# EAGLE design HS100R (EAGLE 7.2.0)
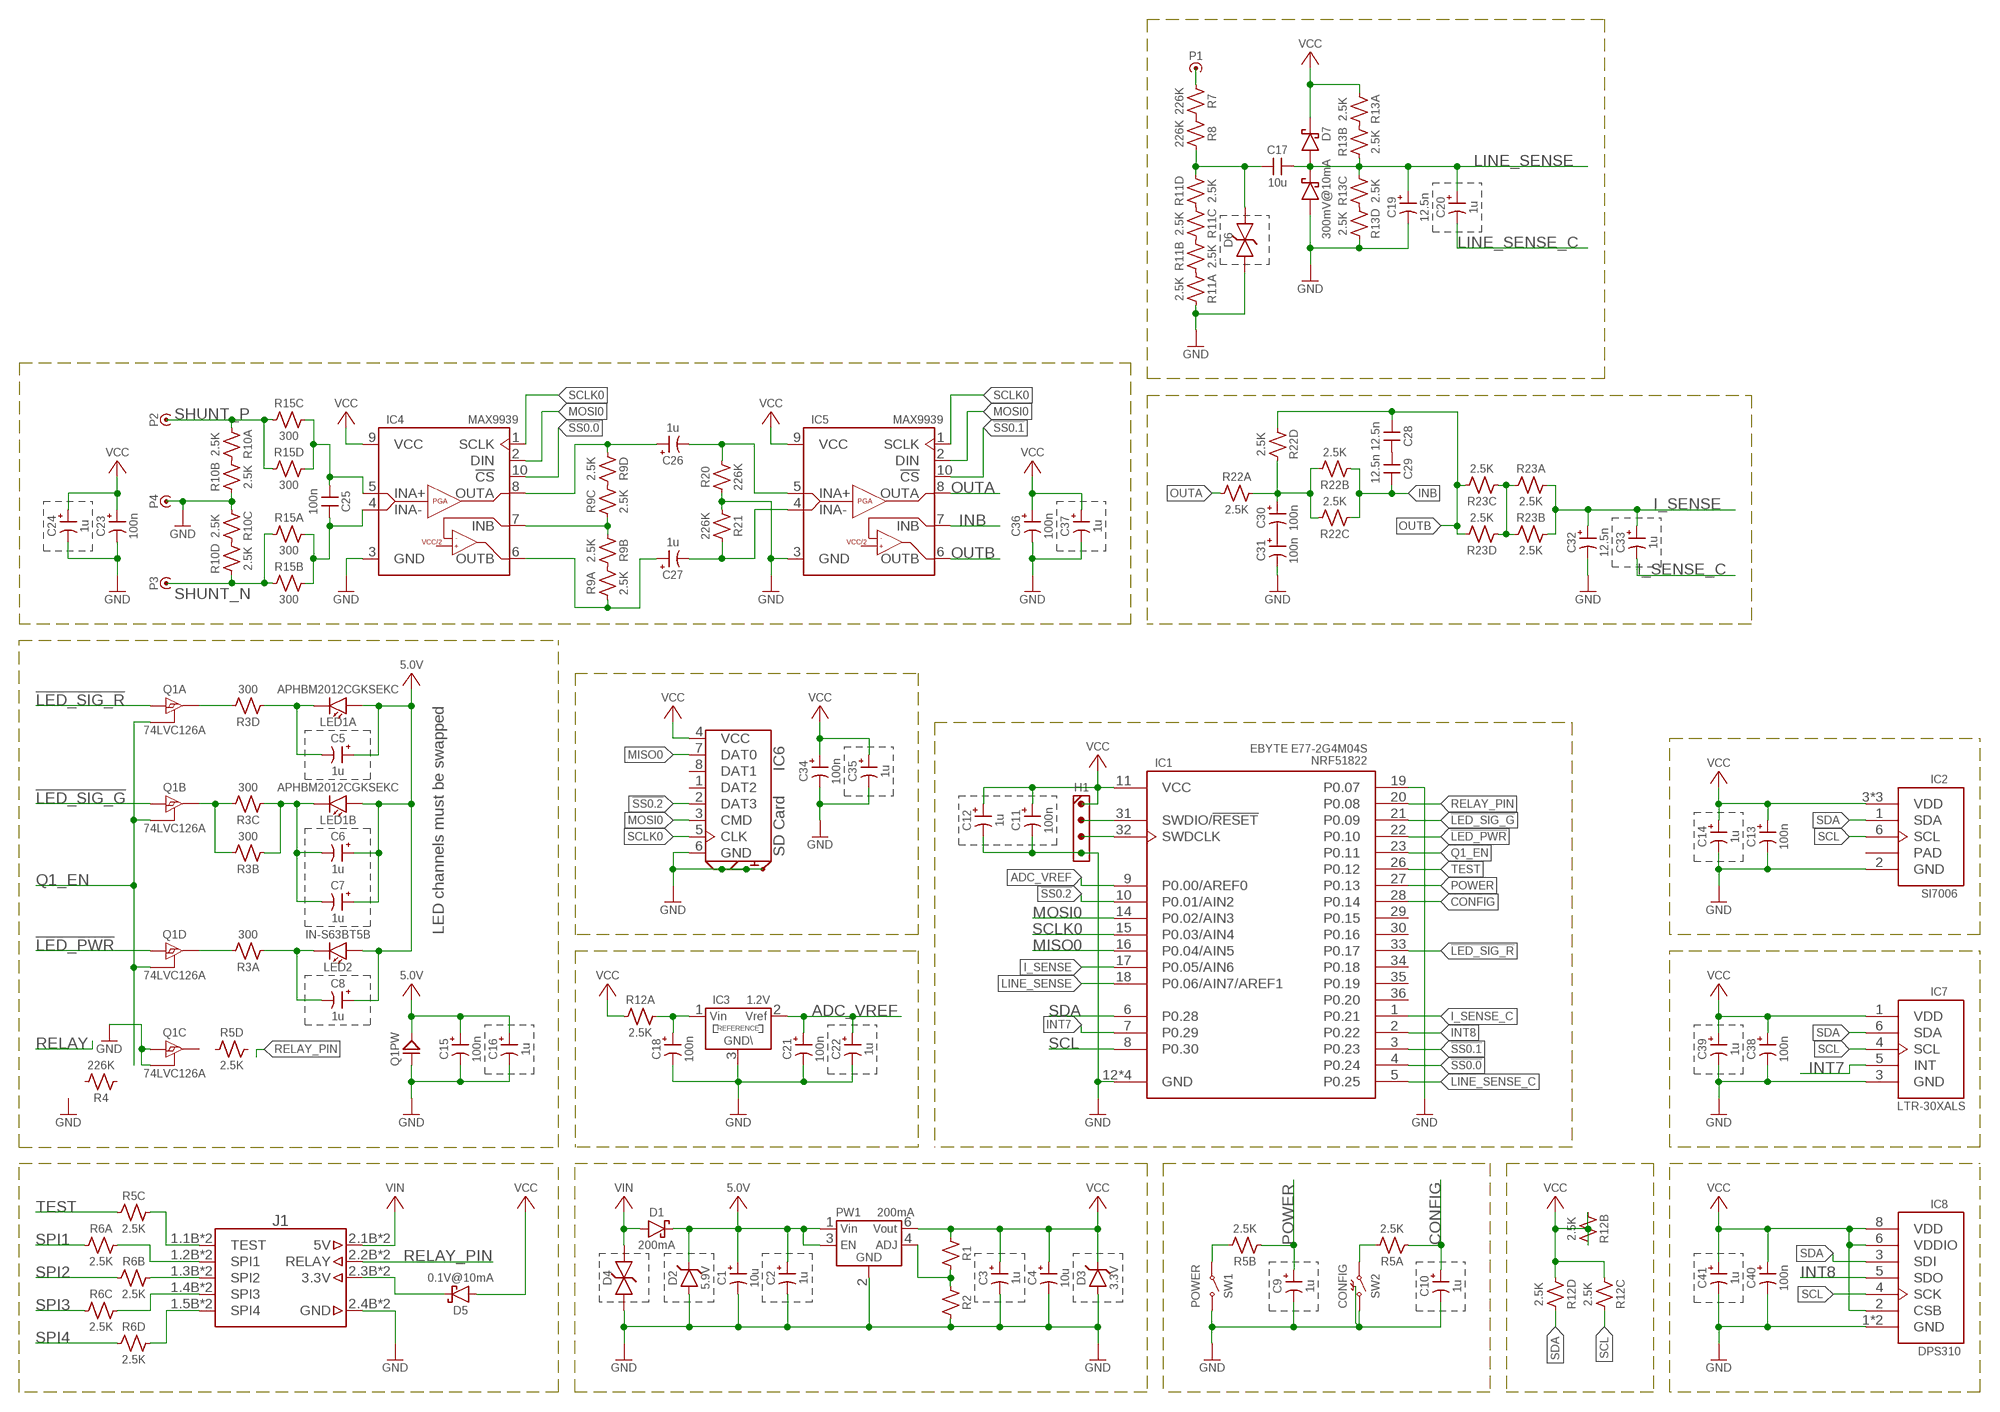
[diagram p0: schematic, sheet 1]

## Parts
C1  10u  CAPACITOR-POL-1206  [1206]
C2  1u  CAPACITOR-POL-0805  [0805]
C3  1u  CAPACITOR-POL-0805  [0805]
C4  10u  CAPACITOR-POL-1206  [1206]
C5  1u  CAPACITOR-POL-0805  [0805]
C6  1u  CAPACITOR-POL-0805  [0805]
C7  1u  CAPACITOR-POL-0805  [0805]
C8  1u  CAPACITOR-POL-0805  [0805]
C9  1u  CAPACITOR-POL-0805  [0805]
C10  1u  CAPACITOR-POL-0805  [0805]
C11  100n  CAPACITOR-POL-0603  [0603]
C12  1u  CAPACITOR-POL-0805  [0805]
C13  100n  CAPACITOR-POL-0603  [0603]
C14  1u  CAPACITOR-POL-0805  [0805]
C15  100n  CAPACITOR-POL-0603  [0603]
C16  1u  CAPACITOR-POL-0805  [0805]
C17  10u  CAPACITOR-1206  [1206]
C18  100n  CAPACITOR-POL-0603  [0603]
C19  12.5n  CAPACITOR-POL-0603  [0603]
C20  1u  CAPACITOR-POL-0805  [0805]
C21  100n  CAPACITOR-POL-0603  [0603]
C22  1u  CAPACITOR-POL-0805  [0805]
C23  100n  CAPACITOR-POL-0603  [0603]
C24  1u  CAPACITOR-POL-0805  [0805]
C25  100n  CAPACITOR-0603  [0603]
C26  1u  CAPACITOR-POL-0805  [0805]
C27  1u  CAPACITOR-POL-0805  [0805]
C28  12.5n  CAPACITOR-0603  [0603]
C29  12.5n  CAPACITOR-0603  [0603]
C30  100n  CAPACITOR-POL-0603  [0603]
C31  100n  CAPACITOR-POL-0603  [0603]
C32  12.5n  CAPACITOR-POL-0603  [0603]
C33  1u  CAPACITOR-POL-0805  [0805]
C34  100n  CAPACITOR-POL-0603  [0603]
C35  1u  CAPACITOR-POL-0805  [0805]
C36  100n  CAPACITOR-POL-0603  [0603]
C37  1u  CAPACITOR-POL-0805  [0805]
C38  100n  CAPACITOR-POL-0603  [0603]
C39  1u  CAPACITOR-POL-0805  [0805]
C40  100n  CAPACITOR-POL-0603  [0603]
C41  1u  CAPACITOR-POL-0805  [0805]
D1  200mA  DIODE_SCHOTTKY-SOD-323F  [SOD-323F]
D2  5.9V  DIODE_ZENER-SOD-323F  [SOD-323F]
D3  3.3V  DIODE_ZENER-SOD-323F  [SOD-323F]
D4  DIODE_TVS_SOD-323F  [SOD-323F]
D5  0.1V@10mA  DIODE_SCHOTTKY-SOD-323F  [SOD-323F]
D6  DIODE_TVS_SOD-323F  [SOD-323F]
D7  300mV@10mA  DIODE_SCHOTTKY-2S_SOT-23  [SOT-23]
H1  HEADER_4X1-4X1  [PIN_1_4X1]
IC1  EBYTE_E77-2G4M04S  [EBYTE_E77-2G4M04S]
IC2  SI7006-A20  [DFN-6_3.0_PAD]
IC3  1.2V  VREF_SOT-23  [SOT-23]
IC4  MAX9939_UMAX-10  [UMAX-10]
IC5  MAX9939_UMAX-10  [UMAX-10]
IC6  SD-CARD-MICRO-B  [SD-MICRO-SPRINGED-B]
IC7  LTR-30XALS  [LTR-30XALS]
IC8  DPS310  [LGA-8_2.0X2.5_0.65]
J1  PCB_CONNECTOR  [PCB_CONNECTOR]
LED1  APHBM2012CGKSEKC  LED-2X-2.00X1.25  [LED_DUAL-2.00X1.25]
LED2  IN-S63BT5B  LED-0603  [0603]
P1  PIN-PIN_R_0.6  [PIN_R_0.6_1X1]
P2  PIN-PIN_R_0.6  [PIN_R_0.6_1X1]
P3  PIN-PIN_R_0.6  [PIN_R_0.6_1X1]
P4  PIN-PIN_R_0.6  [PIN_R_0.6_1X1]
PW1  200mA  VREG_ADJ_EN-SOT-23-5  [SOT-23-5]
Q1  74LVC126A  GATE-BUFFER-TRI-4X-SSOP-14_4.4  [SSOP-14_4.4]
R1  RESISTOR-0603  [0603]
R2  RESISTOR-0603  [0603]
R3  300  RESISTOR-4X-1206  [1206-QUAD]
R4  226K  RESISTOR-1206  [1206]
R5  2.5K  RESISTOR-4X-1206  [1206-QUAD]
R6  2.5K  RESISTOR-4X-1206  [1206-QUAD]
R7  226K  RESISTOR-1206  [1206]
R8  226K  RESISTOR-1206  [1206]
R9  2.5K  RESISTOR-4X-1206  [1206-QUAD]
R10  2.5K  RESISTOR-4X-1206  [1206-QUAD]
R11  2.5K  RESISTOR-4X-1206  [1206-QUAD]
R12  2.5K  RESISTOR-4X-1206  [1206-QUAD]
R13  2.5K  RESISTOR-4X-1206  [1206-QUAD]
R15  300  RESISTOR-4X-1206  [1206-QUAD]
R20  226K  RESISTOR-1206  [1206]
R21  226K  RESISTOR-1206  [1206]
R22  2.5K  RESISTOR-4X-1206  [1206-QUAD]
R23  2.5K  RESISTOR-4X-1206  [1206-QUAD]
SW1  POWER  SWITCH-GULLWING-4_4.2X3.2  [GULLWING-4_4.2X3.2]
SW2  CONFIG  SWITCH_SHIELD-RA_4.5X4.5  [SWITCH-RA_4.5X4.5]

## Nets
5.0V: C1.C(P) C2.C(P) C5.C(P) C6.C(P) C7.C(P) C8.C(P) C15.C(P) C16.C(P) D1.C D2.C LED1.A1(A:ANODE) LED1.A2(B:ANODE) LED2.A(ANODE) PW1.1(VIN) PW1.3(EN) Q1.14(PW:VCC) ; supply symbol labelled VCC-5.0V
!LED_PWR: IC1.22(P0.10) Q1.12(D:IN)
!LED_SIG_G: IC1.21(P0.09) Q1.5(B:IN)
!LED_SIG_R: IC1.33(P0.17) Q1.2(A:IN)
!SS0.0: IC1.4(P0.24) IC4.10(!CS)
!SS0.1: IC1.3(P0.23) IC5.10(!CS)
!SS0.2: IC1.10(P0.01/AIN2) IC6.2(DAT3)
ADC_VREF: C21.C(P) C22.C(P) IC1.9(P0.00/AREF0) IC3.2(VOUT)
CONFIG: C10.C(P) IC1.28(P0.14) R5.1
GND: C1.A(N) C2.A(N) C3.A(N) C4.A(N) C9.A(N) C10.A(N) C11.A(N) C12.A(N) C13.A(N) C14.A(N) C15.A(N) C16.A(N) C18.A(N) C19.A(N) C21.A(N) C22.A(N) C23.A(N) C24.A(N) C31.A(N) C32.A(N) C34.A(N) C35.A(N) C36.A(N) C37.A(N) C38.A(N) C39.A(N) C40.A(N) C41.A(N) D2.A D3.A D4.A D6.A D7.1(A) H1.1.4 IC1.12(GND) IC1.13(GND) IC1.19(P0.07) IC1.24(GND) IC1.25(GND) IC2.2(GND) IC3.3(GND) IC4.3(GND) IC5.3(GND) IC6.6(GND) IC6.DETECT(DETECT1) IC6.SHIELD1(SHIELD) IC6.SHIELD2(SHIELD) IC6.SHIELD3(SHIELD) IC6.SHIELD4(DETECT2) IC7.3(GND) IC8.1(GND) IC8.7(GND) J1.2.4B(GND) J1.2.4T(GND) P4.1.1 PW1.2(GND) Q1.7(PW:GND) Q1.9(C:IN) Q1.10(C:OE) R2.C R10.2 R10.3 R11.8 R13.5 R20.A R21.A SW1.3 SW1.4 SW2.2 SW2.SHIELD
I_SENSE: C32.C(P) C33.C(P) IC1.17(P0.05/AIN6) R23.7 R23.8
I_SENSE_C: C33.A(N) IC1.1(P0.21)
INB: C29.C IC5.7(INB) R22.2 R22.3
INT7: IC1.7(P0.29) IC7.5(INT)
INT8: IC1.2(P0.22) IC8.5(SDO)
LINE_SENSE: C17.C C19.C(P) C20.C(P) D7.3(COMMON) IC1.18(P0.06/AIN7/AREF1) R13.2 R13.6
LINE_SENSE_C: C20.A(N) IC1.5(P0.25)
MISO0: IC1.16(P0.04/AIN5) IC6.7(DAT0)
MOSI0: IC1.14(P0.02/AIN3) IC4.2(DIN) IC5.2(DIN) IC6.3(CMD)
N$1: D5.C J1.2.3B(3.3V) J1.2.3T(3.3V)
N$2: Q1.3(A:OUT) R3.5
N$3: PW1.4(ADJ) R1.C R2.A
N$4: C5.A(N) LED1.K1(A:CATHODE) R3.4
N$5: Q1.11(D:OUT) R3.8
N$6: Q1.6(B:OUT) R3.6 R3.7
N$7: C8.A(N) LED2.C(CATHODE) R3.1
N$8: J1.1.2B(SPI1) J1.1.2T(SPI1) R6.8
N$9: C6.A(N) C7.A(N) LED1.K2(B:CATHODE) R3.2 R3.3
N$10: R5.7 SW1.1 SW1.2
N$11: R11.3 R11.4
N$12: R5.8 SW2.1
N$13: J1.1.1B(TEST) J1.1.1T(TEST) R5.6
N$14: J1.1.3B(SPI2) J1.1.3T(SPI2) R6.7
N$15: J1.1.4B(SPI3) J1.1.4T(SPI3) R6.6
N$16: J1.1.5B(SPI4) J1.1.5T(SPI4) R6.5
N$17: P1.1.1 R7.A
N$18: R7.C R8.A
N$19: H1.1.3 IC1.32(SWDCLK)
N$20: H1.1.2 IC1.31(SWDIO/!RESET)
N$21: C17.A D6.C R8.C R11.5
N$22: C18.C(P) IC3.1(VIN) R12.8
N$23: R13.7 R13.8
N$24: R13.3 R13.4
N$25: C25.A IC4.5(INA+) R15.5 R15.6
N$26: C25.C IC4.4(INA-) R15.7 R15.8
N$27: IC4.7(INB) R9.2 R9.3
N$28: C28.C C29.A
N$29: R11.6 R11.7
N$30: C30.C(P) R22.5 R22.6 R22.7 R22.8
N$31: C26.A(N) IC5.5(INA+) R20.C
N$32: R23.1 R23.2 R23.3 R23.4
N$33: C27.A(N) IC5.4(INA-) R21.C
N$34: C26.C(P) IC4.8(OUTA) R9.4
N$35: R9.5 R9.6
N$36: C30.A(N) C31.C(P)
N$37: R9.7 R9.8
N$38: C27.C(P) IC4.6(OUTB) R9.1
N$39: R10.5 R10.6
N$40: R10.7 R10.8
N$41: R11.1 R11.2
OUTA: IC5.8(OUTA) R22.1
OUTB: C28.A IC5.6(OUTB) R22.4 R23.5 R23.6
POWER: C9.C(P) IC1.27(P0.13) R5.2
Q1_EN: IC1.23(P0.11) Q1.1(A:OE) Q1.4(B:OE) Q1.13(D:OE)
RELAY_PIN: IC1.20(P0.08) J1.2.2B(RELAY) J1.2.2T(RELAY)
SCL: IC1.8(P0.30) IC2.6(SCL) IC7.4(SCL) IC8.4(SCK) R12.6
SCLK0: IC1.15(P0.03/AIN4) IC4.1(SCLK) IC5.1(SCLK) IC6.5(CLK)
SDA: IC1.6(P0.28) IC2.1(SDA) IC7.6(SDA) IC8.3(SDI) R12.5
SHUNT_N: P3.1.1 R10.4 R15.1 R15.2
SHUNT_P: P2.1.1 R10.1 R15.3 R15.4
SPI1: R6.1
SPI2: R6.2
SPI3: R6.3
SPI4: R6.4
TEST: IC1.26(P0.12) R5.3
VCC: C3.C(P) C4.C(P) C11.C(P) C12.C(P) C13.C(P) C14.C(P) C23.C(P) C24.C(P) C34.C(P) C35.C(P) C36.C(P) C37.C(P) C38.C(P) C39.C(P) C40.C(P) C41.C(P) D3.C D5.A D7.2(C) H1.1.1 IC1.11(VCC) IC2.3(VDD) IC2.4(VDD) IC2.5(VDD) IC4.9(VCC) IC5.9(VCC) IC6.4(VCC) IC7.1(VDD) IC8.2(CSB) IC8.6(VDDIO) IC8.8(VDD) PW1.6(VOUT) R1.A R12.1 R12.2 R12.3 R12.4 R12.7 R13.1
VIN: D1.A D4.C J1.2.1B(5V) J1.2.1T(5V)
Unconnected: IC1.29(P0.15) IC1.30(P0.16) IC1.34(P0.18) IC1.35(P0.19) IC1.36(P0.20) IC2.CENTER(PAD) IC6.1(DAT2) IC6.8(DAT1) Q1.8(C:OUT) R4.A R4.C R5.4 R5.5

## Notes on the sheet
- LED channels must be swapped

## Library data of the parts
C1-C16 C18-C24 C26 C27 C30-C41 = MainLib:CAPACITOR-POL: Standard SMD Capacitor
C17 C25 C28 C29 = MainLib:CAPACITOR: Standard SMD Capacitor
D1 D5 = MainLib:DIODE_SCHOTTKY
D2 D3 = MainLib:DIODE_ZENER
D4 D6 = MainLib:DIODE_TVS
D7 = MainLib:DIODE_SCHOTTKY-2S
H1 = Modules:HEADER_4X1
IC1 = Modules:EBYTE_E77-2G4M04S
IC2 = MainLib:SI7006-A20
IC3 = MainLib:VREF
IC4 IC5 = MainLib:MAX9939
IC6 = MainLib:SD-CARD
IC7 = MainLib:LTR-30XALS
IC8 = MainLib:DPS310
J1 = HS100R:PCB_CONNECTOR
LED1 = MainLib:LED-2X
LED2 = MainLib:LED
P1-P4 = Modules:PIN
PW1 = MainLib:VREG_ADJ_EN
Q1 = MainLib:GATE-BUFFER-TRI-4X
R1 R2 R4 R7 R8 R20 R21 = MainLib:RESISTOR: Standard SMD Resistor
R3 R5 R6 R9-R13 R15 R22 R23 = MainLib:RESISTOR-4X
SW1 = MainLib:SWITCH
SW2 = MainLib:SWITCH_SHIELD

## Board
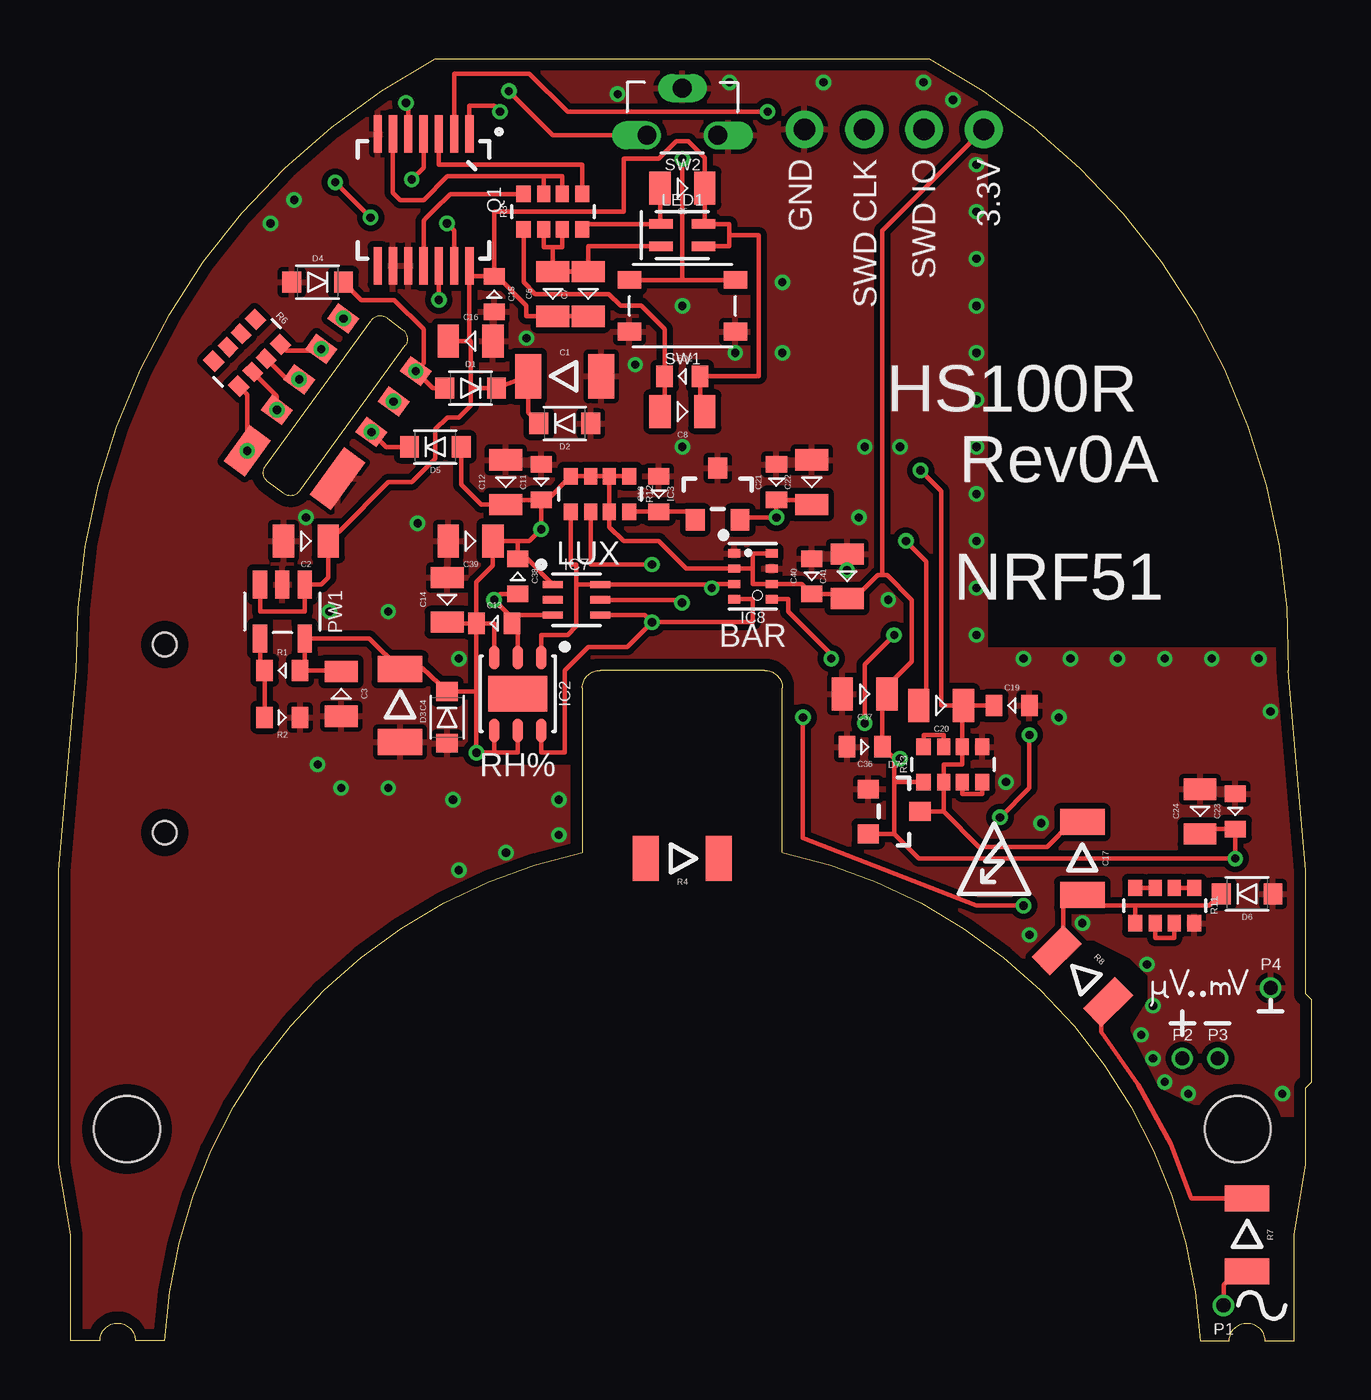
[diagram p1: board, top side]
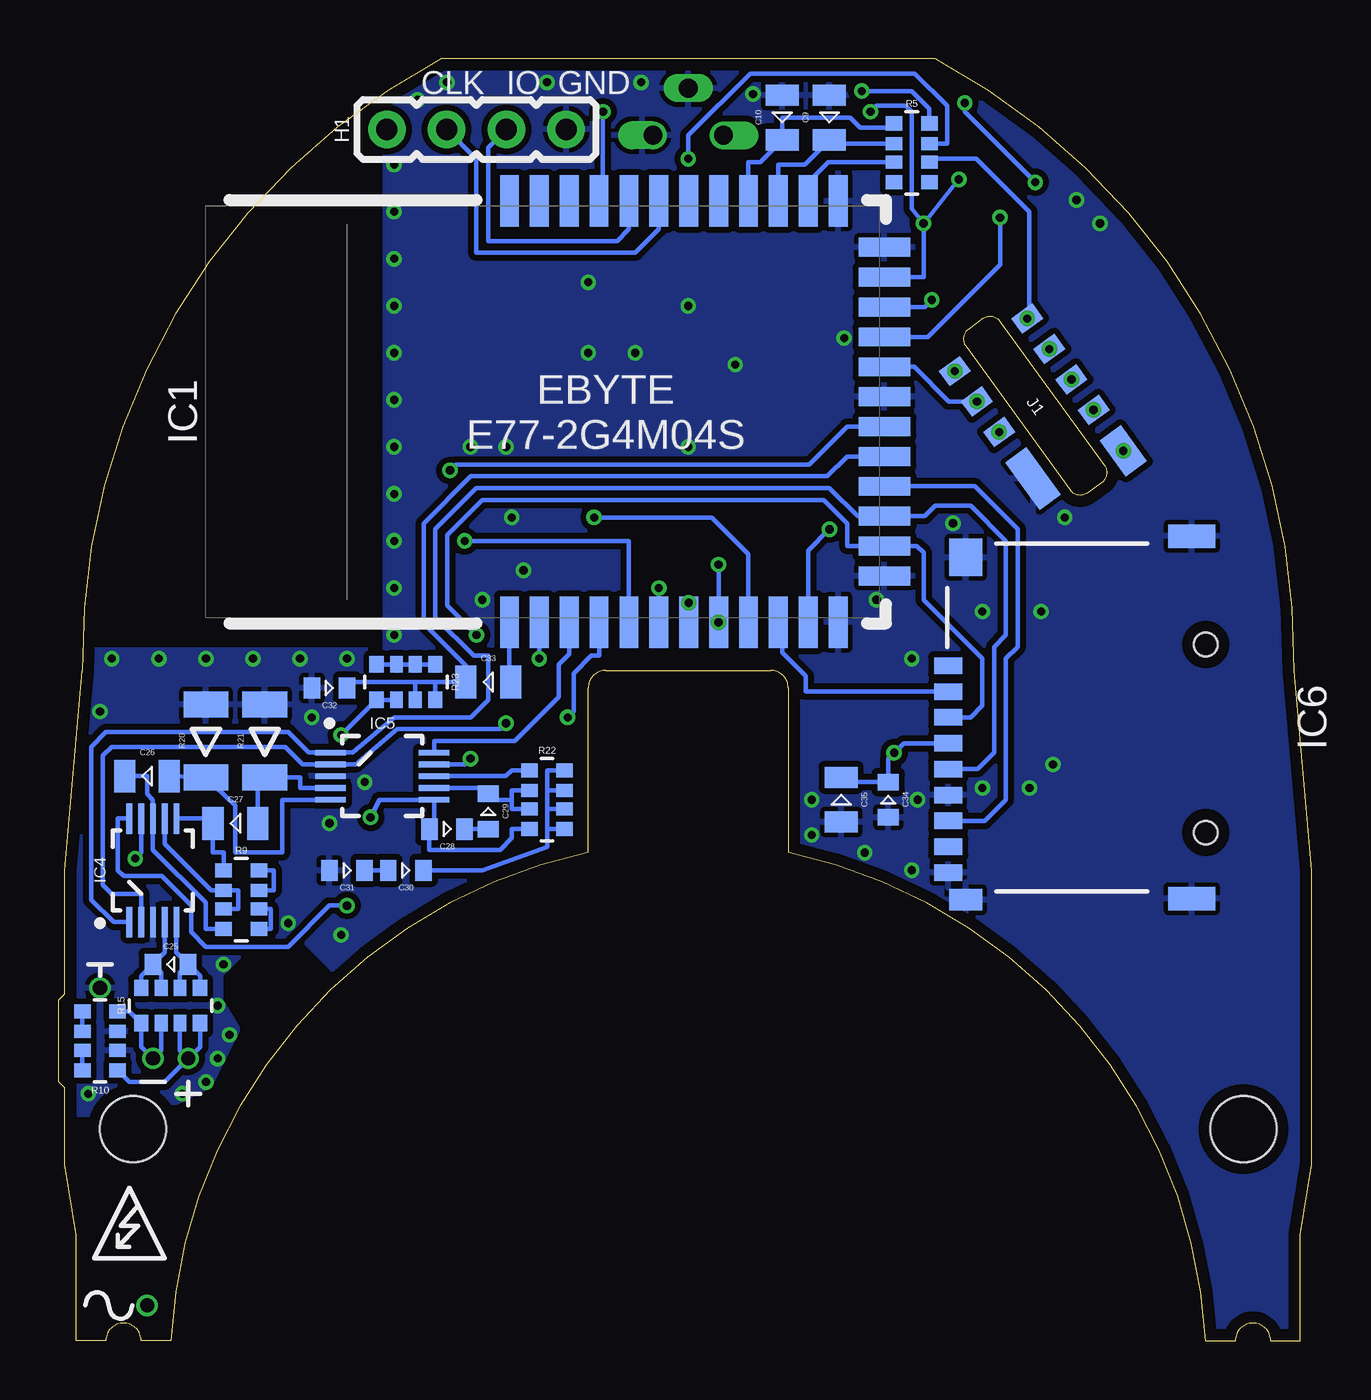
[diagram p2: board, bottom side, seen from below]

Size 53.25 x 54.5 mm. Coordinates in mm from the lower left corner, seen from the top.
Outline: 48.5,0 49.75,0 arc-180 51.25,0 52.5,0 52.5,4.5 53,7.5 53,10.75 53.25,11 53.25,14.5 53,14.75 53,20 52.25,28.5 arc63 37,54.5 16,54.5 arc63 0.75,28.5 0,20 0,7.5 0.5,4.5 0.5,0 1.75,0 arc-180 3.25,0 4.5,0 arc-75 22.25,20.75 22.25,27.75 arc-90 23,28.5 30,28.5 arc-90 30.75,27.75 30.75,20.75 arc-75 48.5,0
Copper layers (1*16): Top 0.035mm / dielectric 1.6mm / Bottom 0.035mm
Design rules "Elecrow_2-layer_Modified": minimum track width 0.2mm, minimum drill 0.35mm, track to track 0.25mm, track to pad 0.25mm, pad to pad 0.25mm, via to via 0.25mm, smd to smd 0mil, copper to edge 0.5mm, drill to drill 0.3mm, minimum pad ring 6mil, minimum via ring 6mil, stop-mask expansion 0mil, vias tented up to drill 100mil, thermal gap 0.2mm
Holes 2.8 mm at 50.1,9 2.9,9
tRestrict: area 18,24.5 to 22.5,33; area 39.5,29.5 to 58.5,60.5; area 45.5,-0.5 to 53.5,9.5; area 40.5,9.5 to 48.5,17
bRestrict: area 39.5,29.5 to 58.5,60.5; area 45.5,-0.5 to 53.5,9.5; area 40.5,9.5 to 48.5,17; area 50.5,12.5 to 51,13

### Footprints (pad centres in the part's own frame; a part is rotated, then mirrored left to right if it is on the bottom)
1206 = smd 1.1 x 1.9: A -1.55,0; C 1.55,0
0805 = smd 0.9 x 1.4: A -0.95,0; C 0.95,0
0603 = smd 0.7 x 0.9: A -0.75,0; C 0.75,0
SOD-323F = smd 0.8 x 0.9: A -1.1,0; C 1.1,0
SOT-23 = smd 0.8 x 0.9: 1 -0.95,-1.1; 2 0.95,-1.1; 3 0,1.1
PIN_1_4X1 = drill 0.9 pad 1.6: 1.1 0,3.81; 1.2 0,1.27; 1.3 0,-1.27; 1.4 0,-3.81
EBYTE_E77-2G4M04S = smd 2.2 x 0.8: 1 -8.955,-12.9; 2 -8.955,-14.17; 3 -8.955,-15.44; 4 -8.955,-16.71; 5 -8.955,-17.98; 6 -8.955,-19.25; 7 -8.955,-20.52; 8 -8.955,-21.79; 9 -8.955,-23.06; 10 -8.955,-24.33; 11 -8.955,-25.6; 12 -8.955,-26.87; 25 8.955,-26.87; 26 8.955,-25.6; 27 8.955,-24.33; 28 8.955,-23.06; 29 8.955,-21.79; 30 8.955,-20.52; 31 8.955,-19.25; 32 8.955,-17.98; 33 8.955,-16.71; 34 8.955,-15.44; 35 8.955,-14.17; 36 8.955,-12.9 | smd 0.8 x 2.2: 13 -6.985,-28.84; 14 -5.715,-28.84; 15 -4.445,-28.84; 16 -3.175,-28.84; 17 -1.905,-28.84; 18 -0.635,-28.84; 19 0.635,-28.84; 20 1.905,-28.84; 21 3.175,-28.84; 22 4.445,-28.84; 23 5.715,-28.84; 24 6.985,-28.84
DFN-6_3.0_PAD = smd 1 x 0.45: 1 -1.55,1; 2 -1.55,0; 3 -1.55,-1; 4 1.55,-1; 5 1.55,0; 6 1.55,1 | smd 1.5 x 2.5: CENTER 0,0
UMAX-10 = smd 1.3 x 0.25: 1 -2.2,1; 2 -2.2,0.5; 3 -2.2,0; 4 -2.2,-0.5; 5 -2.2,-1; 6 2.2,-1; 7 2.2,-0.5; 8 2.2,0; 9 2.2,0.5; 10 2.2,1
SD-MICRO-SPRINGED-B = smd 0.7 x 1.2: 1 -2.2,0.05; 2 -1.1,0.05; 3 0,0.05; 4 1.1,0.05; 5 2.2,0.05; 6 3.3,0.05; 7 4.4,0.05; 8 5.5,0.05; DETECT 6.6,0.05 | smd 1 x 2: SHIELD1 -7.7,10.4; SHIELD2 7.7,10.4 | smd 1.6 x 1.4: SHIELD3 -6.8,0.8 | smd 0.9 x 1.4: SHIELD4 7.75,0.8 | hole 1: 4.9,11; -3.1,11
LTR-30XALS = smd 0.85 x 0.3: 1 -1,0.65; 2 -1,0; 3 -1,-0.65; 4 1,-0.65; 5 1,0; 6 1,0.65
LGA-8_2.0X2.5_0.65 = smd 0.5 x 0.35: 1 -0.8,0.975; 2 -0.8,0.325; 3 -0.8,-0.325; 4 -0.8,-0.975; 5 0.8,-0.975; 6 0.8,-0.325; 7 0.8,0.325; 8 0.8,0.975
PCB_CONNECTOR = smd 0.8 x 1.1 bottom: 1.1B -3.2,1.9; 1.2B -1.6,1.9; 1.3B 0,1.9; 1.4B 1.6,1.9; 2.1B -3.2,-1.9; 2.2B -1.6,-1.9; 2.3B 0,-1.9 | smd 0.8 x 1.1: 1.1T -3.2,1.9; 1.2T -1.6,1.9; 1.3T 0,1.9; 1.4T 1.6,1.9; 2.1T -3.2,-1.9; 2.2T -1.6,-1.9; 2.3T 0,-1.9 | smd 1.9 x 1.1 bottom: 1.5B 3.75,1.9 | smd 1.9 x 1.1: 1.5T 3.75,1.9 | smd 2.5 x 1.1 bottom: 2.4B 2.45,-1.9 | smd 2.5 x 1.1: 2.4T 2.45,-1.9
LED_DUAL-2.00X1.25 = smd 1 x 0.4: A1 0.9,0.475; A2 0.9,-0.475; K1 -0.9,0.475; K2 -0.9,-0.475
PIN_R_0.6_1X1 = drill 0.6: 1.1 0,0
SOT-23-5 = smd 0.6 x 1.2: 1 -0.95,-1.15; 2 0,-1.15; 3 0.95,-1.15; 4 0.95,1.15; 6 -0.95,1.15
SSOP-14_4.4 = smd 1.6 x 0.35: 1 -2.8,1.95; 2 -2.8,1.3; 3 -2.8,0.65; 4 -2.8,0; 5 -2.8,-0.65; 6 -2.8,-1.3; 7 -2.8,-1.95; 8 2.8,-1.95; 9 2.8,-1.3; 10 2.8,-0.65; 11 2.8,0; 12 2.8,0.65; 13 2.8,1.3; 14 2.8,1.95
1206-QUAD = smd 0.6 x 0.7: 1 -1.25,-0.75; 4 1.25,-0.75; 5 1.25,0.75; 8 -1.25,0.75 | smd 0.55 x 0.7: 2 -0.4,-0.75; 3 0.4,-0.75; 6 0.4,0.75; 7 -0.4,0.75
GULLWING-4_4.2X3.2 = smd 1 x 0.75: 1 -2.25,-1.1; 2 2.25,-1.1; 3 2.25,1.1; 4 -2.25,1.1
SWITCH-RA_4.5X4.5 = drill 0.8 offset: 1 -1.5,-2; 2 1.5,-2 | drill 0.8 long: SHIELD 0,0

### Placement (x,y rotation side)
C1  21.5,41 180 top
C2  10.5,34 0 top
C3  12,27.5 90 top
C4  14.5,27 90 top
C5  26.5,49 0 top
C6  21,44.5 270 top
C7  22.5,44.5 270 top
C8  26.5,39.5 0 top
C9  20.5,52 270 bottom
C10  22.5,52 270 bottom
C11  20.5,36.5 270 top
C12  19,36.5 270 top
C13  18.5,30.5 180 top
C14  16.5,31.5 270 top
C15  18.5,44.5 90 top
C16  17.5,42.5 180 top
C17  43.5,20.5 90 top
C18  25.5,36 270 top
C19  40.5,27 180 top
C20  37.5,27 0 top
C21  30.5,36.5 270 top
C22  32,36.5 270 top
C23  50,22.5 270 top
C24  48.5,22.5 270 top
C25  48.5,16 180 bottom
C26  49.5,24 180 bottom
C27  45.75,22 180 bottom
C28  36.75,21.75 0 bottom
C29  35,22.5 90 bottom
C30  38.5,20 0 bottom
C31  41,20 0 bottom
C32  41.75,27.75 0 bottom
C33  35,28 180 bottom
C34  18,23 90 bottom
C35  20,23 90 bottom
C36  34.25,25.25 0 top
C37  34.25,27.5 0 top
C38  19.5,32.5 90 top
C39  17.5,34 0 top
C40  32,32.5 270 top
C41  33.5,32.5 270 top
D1  17.5,40.5 0 top
D2  21.5,39 180 top
D3  16.5,26.5 90 top
D4  11,45 0 top
D5  16,38 180 top
D6  50.5,19 180 top
D7  35.5,22.5 270 top
H1  35.5,51.5 90 bottom
IC1  47,39.5 90 bottom
IC2  19.5,27.5 270 top
IC3  28,36 0 top
IC4  49.25,20 90 bottom
IC5  39.5,24 0 bottom
IC6  15.5,26.5 270 bottom
IC7  22,31.5 0 top
IC8  29.5,32.5 0 top
J1  11.75,39.75 306 bottom
LED1  26.5,47 0 top
LED2  26.5,41 180 top
P1  49.5,1.5 180 top
P2  47.75,12 0 top
P3  49.25,12 0 top
P4  51.5,15 0 top
PW1  9.5,31 180 top
Q1  15.5,48.5 270 top
R1  9.5,28.5 180 top
R2  9.5,26.5 0 top
R3  21,48 0 top
R4  26.5,20.5 0 top
R5  17,50.5 270 bottom
R6  8,42 225 top
R7  50.5,4.5 90 top
R8  43.5,15.5 135 top
R9  45.5,18.75 270 bottom
R10  51.5,12.75 90 bottom
R11  47,18.5 180 top
R12  23,36 180 top
R13  38,24.5 0 top
R15  48.5,14.25 0 bottom
R20  47,25.5 270 bottom
R21  44.5,25.5 270 bottom
R22  32.5,23 270 bottom
R23  38.5,28 180 bottom
SW1  26.5,44 180 top
SW2  26.5,53.25 0 top

### Tracks (layer width: path | path; a pad name or v marks a point on that pad's centre or on a via)
5.0V
  Top 0.2: C8.C 27.25,39.7 LED2.A 29.75,41 29.75,47 28.5,47 | 28.5,47 28.5,47.48 LED1.A1 27.45,47.48 C5.C 27.45,50.3 26.75,51 26.25,51 25.5,50.25 24,50.25 24,48 18.5,48 C15.C | 28.5,47 28.5,46.52 LED1.A2 | 17.5,40.5 D1.C C1.C 19.95,39.45 D2.C | 17.5,40.5 17.5,42.5 17.45,42.5 | C16.C 17.45,42.5 | 17.45,42.5 Q1.14 17.45,45.25 C15.C | C7.C C6.C 19.88,43.55 19.88,44 18.62,45.25 C15.C | PW1.3 8.55,31 10.45,31 PW1.1 11.15,32.15 11.45,32.45 C2.C 11.95,34.45 14,36.5 15,36.5 16,37.5 16,38.75 16.5,39.25 17,39.25 17.5,39.75 17.5,40.5
!LED_PWR  (via drill 0.35)
  Top 0.2: Q1.12 v16.15,44.25
  Bottom 0.2: v16.15,44.25 16.45,43.95 IC1.22
!LED_SIG_G  (via drill 0.35)
  Top 0.2: v13.25,47.75 v11.75,49.25 | v14.75,52.62 14.85,52.52 Q1.5
  Bottom 0.2: IC1.21 16.32,42.67 13.25,45.75 v13.25,47.75 | v11.75,49.25 14.75,52.25 v14.75,52.62
!LED_SIG_R  (via drill 0.35)
  Top 0.2: v30.12,52.25 21.62,52.25 20,53.88 16.8,53.88 Q1.2
  Bottom 0.2: IC1.33 30.12,48.62 v30.12,52.25
!SS0.0  (via drill 0.35)
  Top 0.2: v41,18.5 39,18.5 31.62,21.38 v31.62,26.5
  Bottom 0.2: IC1.4 30.29,29.12 30.62,29.12 31.38,28.38 31.38,26.75 v31.62,26.5 | IC4.10 50.75,22.2 50.75,20 50.5,19.75 48.88,19.75 47.62,18.5 47.62,17.38 47,16.75 43.5,16.75 41.75,18.5 v41,18.5
!SS0.1
  Bottom 0.2: IC1.3 31.56,29.19 32,28.75 32,27.38 33.88,25.5 37.3,25.5 IC5.10
!SS0.2
  Bottom 0.2: IC6.2 21.5,27.6 21.5,28.25 22.5,29.25 22.5,30.55 IC1.10
ADC_VREF  (via drill 0.35)
  Top 0.2: C22.C 32,35.75 C21.C v30.5,35 29.05,35 IC3.2
  Bottom 0.2: IC1.9 23.94,33.44 25.5,35 v30.5,35
CONFIG
  Bottom 0.2: IC1.28 23.94,50.11 23.44,50.11 C10.C 22.5,52 19.62,52 19.19,51.56 17.94,51.56 R5.1
GND  (via drill 0.35)
  Top 0.2: IC7.3 19.15,30.85 | 19.15,30.85 v18.5,31.5 18.75,31.75 C38.A | 19.15,30.85 19.15,30.6 C13.A 19.5,30.25 IC2.2
  other vias: 15.25,34.75 14,31 14,23.5 10.5,35 19.88,42.62 24.5,41.5 9,47.5 10,48.5 12,23.5 11,24.5 23.75,53 11.5,31 17,29 26.5,38 48,10.5 47,11 46.5,12 46,13 46.5,14.25 46.25,16 43.5,17.75 41.25,17.25 45,29 47,29 49,29 51,29 51.5,26.75 43,29 42.5,26.5 41,29 40.25,23.75 41.75,22 34,35 35.25,31.5 33.5,32.75 34.25,38 35.75,38 39,30 39,32 39,34 39,36 39,38 39,40 39,42 39,44 39,46 39,48 39,50 52,10.5 26.5,44 28.75,42 30.75,42 30.75,45 38,52.75 36.75,53.5 28.5,53.5 32.5,53.5 16.75,23 21.25,23 21.25,21.5 19,20.75 17,20
  pour Bottom: -5.5,-3.5 58.5,-3.5 58.5,60.5 -5.5,60.5
  pour Top: -5.5,-3.5 58.5,-3.5 58.5,60.5 -5.5,60.5
I_SENSE
  Bottom 0.2: IC1.17 19.75,37.59 20.59,36.75 35.75,36.75 37.75,34.75 37.75,30.5 35.95,28.7 C33.C 37.25,28 | 37.25,28 38.1,28 | 38.1,28 41,28 C32.C | R23.8 37.25,28 | R23.7 38.1,28
I_SENSE_C
  Bottom 0.2: IC1.1 34.1,28.05 C33.A
INB
  Bottom 0.2: 34,23 35,23 C29.C 35,23.5 IC5.7 | R22.2 34,23.4 34,23 | R22.3 34,22.6 34,23
INT7  (via drill 0.35)
  Top 0.2: IC7.5 26.48,31.5 v26.48,31.38
  Bottom 0.2: v26.48,31.38 IC1.7
INT8  (via drill 0.35)
  Top 0.2: IC8.5 31,31.52 31,31 32.83,29.17 v32.83,29
  Bottom 0.2: IC1.2 v32.83,29
LINE_SENSE  (via drill 0.35)
  Top 0.2: C20.C 37.5,27 37.5,36.12 v36.62,37 | C20.C 38.4,27 R13.6 38.4,24.5 37.6,24.5 R13.2 37.6,22.5 | C20.C C19.C | D7.3 37.6,22.5 | C17.C 43.05,22.05 42,21 39.1,21 37.6,22.5
  Bottom 0.2: IC1.18 19.75,38.87 21.37,37.25 36.38,37.25 v36.62,37
LINE_SENSE_C  (via drill 0.35)
  Top 0.2: C20.A 36.88,27.32 36.88,33.12 v36,34
  Bottom 0.2: v36,34 29.02,34 IC1.5
MISO0
  Bottom 0.2: IC6.7 13.9,22.1 13,23 13,29 12.5,29.5 12.5,34.5 14.32,36.33 IC1.16
MOSI0  (via drill 0.35)
  Top 0.2: v34.25,26.25 34.25,28.75 v35.5,30
  Bottom 0.2: IC6.3 14.5,26.5 14,27 14,29 16.5,31.5 16.5,33.5 16.79,33.78 IC1.14 19.75,33.78 19.75,34.75 20.75,35.75 35.25,35.75 36.75,34.25 36.75,31.25 v35.5,30 | v34.25,26.25 34.5,26 38.88,26 40.62,24.5 IC5.2 42.88,24.5 43.62,25.25 51,25.25 51.38,24.88 51.38,19.38 51,19 49.75,19 IC4.2
N$1  (via drill 0.35)
  Top 0.2: D5.C 13.92,38 J1.2.3B
  other vias: 13.29,38.63
N$2
  Top 0.2: R3.5 22.25,50 16.15,50 Q1.3
N$3
  Top 0.2: PW1.4 8.55,28.7 R1.C R2.A
N$4
  Top 0.2: R3.4 22.25,47.48 LED1.K1 25.55,47.48 C5.A
N$5
  Top 0.2: R3.8 16.62,48.75 15.94,48.06 15.62,47.75 15.5,47.62 Q1.11
N$6
  Top 0.2: R3.7 20.6,49.5 | 20.6,49.5 21.4,49.5 R3.6 | Q1.6 14.2,48.8 14.5,48.5 15.5,48.5 16.5,49.5 20.6,49.5
N$7
  Top 0.2: C8.A 25.75,39.7 LED2.C 25.75,43 24.75,44 23.88,44 23.38,44.5 20.25,44.5 19.75,45 R3.1
N$8  (via drill 0.35)
  Top 0.2: R6.8 9.66,42.1 11.1,42.1 J1.1.2T
  other vias: 11.15,42.16
N$9
  Top 0.2: R3.2 20.6,46.5 21,46.5 | R3.3 21.4,46.5 21,46.5 | LED1.K2 22.5,46.52 C7.A C6.A 21,46.5
N$10  (via drill 0.35)
  Top 0.2: SW1.1 SW1.2 26.5,45.1 v26.5,50.25
  Bottom 0.2: v26.5,50.25 26.5,51.25 23.88,53.88 16.88,53.88 15.5,52.5 15.5,50.9 R5.7
N$11
  Top 0.2: R11.4 R11.3
N$12  (via drill 0.35)
  Top 0.2: SW2.1 21,51.25 v19.12,53.12
  Bottom 0.2: R5.8 16.25,52.38 17,53.12 v19.12,53.12
N$13  (via drill 0.35)
  Bottom 0.2: R5.6 16.1,50.25 14.25,50.25 12,48 12,43.55 J1.1.1T
  other vias: 12.09,43.46
N$14  (via drill 0.35)
  Top 0.2: R6.7 9.7,40.87 J1.1.3T
  other vias: 10.21,40.87
N$15  (via drill 0.35)
  Top 0.2: R6.6 9.27,40.16 J1.1.4T
  other vias: 9.27,39.57
N$16  (via drill 0.35)
  Top 0.2: R6.5 8.01,40.22 J1.1.5T
  other vias: 8.01,37.83
N$17
  Top 0.2: P1.1.1 49.5,2.38 50.08,2.95 R7.A
N$18
  Top 0.2: R7.C 48.12,6.05 47.25,8.38 45.88,10.88 44.31,13.12 44.31,14.12 R8.A
N$19
  Bottom 0.2: IC1.32 29.02,47.25 29.52,46.75 35,46.75 35,50.73 H1.1.3
N$20
  Bottom 0.2: IC1.31 27.75,47.25 28.75,46.25 35.5,46.25 35.5,50.23 H1.1.2
N$21
  Top 0.2: 45.75,18.5 43.95,18.5 C17.A 42.69,18.95 42.69,16.6 R8.C | 45.75,18.5 48.9,18.5 D6.C | R11.5 45.75,18.5
N$22
  Top 0.2: R12.8 C18.C 27.05,35.25 IC3.1
N$23
  Top 0.2: R13.8 36.75,25.75 37.6,25.75 R13.7
N$24
  Top 0.2: R13.4 39.25,23.25 38.4,23.25 R13.3
N$25
  Bottom 0.2: 48.25,15 R15.6 48.1,15.65 C25.A | C25.A 47.25,15.5 R15.5 | C25.A 48.25,16.5 IC4.5
N$26
  Bottom 0.2: 48.75,15 R15.7 48.9,15.65 C25.C | C25.C 49.75,15.5 R15.8 | C25.C 48.75,16.5 IC4.4
N$27
  Bottom 0.2: IC4.7 48.75,21.12 46.77,19.15 R9.2 45.62,19.15 45.62,18.35 R9.3
N$28
  Bottom 0.2: C29.A C28.C
N$29
  Top 0.2: R11.6 46.6,17.12 47.4,17.12 R11.7
N$30
  Bottom 0.2: R22.8 32.5,24.25 32.5,23.4 | 32.5,23.4 32.5,22.6 | 32.5,22.6 32.5,21.75 | 32.5,21.75 32.5,21 35.25,20 C30.C | R22.7 32.5,23.4 | R22.6 32.5,22.6 | R22.5 32.5,21.75
N$31
  Bottom 0.2: C26.A R20.C 45.75,22.75 45.75,20.75 43.75,20.75 43.75,23 IC5.5
N$32
  Bottom 0.2: R23.4 R23.3 R23.2 R23.1
N$33
  Bottom 0.2: IC5.4 43,23.5 43,23.95 R21.C 44.8,23.95 C27.A
N$34
  Bottom 0.2: R9.4 47,17.5 47,18.62 49.25,20.88 IC4.8 49.25,23 49.5,23.25 49.5,24 C26.C
N$35
  Bottom 0.2: R9.5 44.25,17.5 44.25,18.35 R9.6
N$36
  Bottom 0.2: C30.A C31.C
N$37
  Bottom 0.2: R9.8 44.12,20 44.12,19.15 R9.7
N$38
  Bottom 0.2: IC4.6 46.7,22.2 C27.C 46.7,20.75 46.25,20.75 R9.1
N$39
  Bottom 0.2: R10.6 R10.5
N$40
  Bottom 0.2: R10.8 R10.7
N$41
  Top 0.2: R11.2 R11.1
OUTA
  Bottom 0.2: IC5.8 34.25,24 34,24.25 R22.1
OUTB  (via drill 0.35)
  Top 0.2: v40,22.25 41.25,23.5 v41.25,25.75
  Bottom 0.2: R23.6 R23.5 v41.25,25.75 | v40,22.25 39.62,23 IC5.6 37.3,22 37.5,22 C28.A 37.5,20.88 34.5,20.88 34,21.38 34,21.75 R22.4
POWER
  Bottom 0.2: IC1.27 22.67,50 21.55,50 C9.C 20.35,50.9 R5.2
Q1_EN  (via drill 0.35)
  Top 0.2: v16.5,47.5 16.8,47.2 Q1.13 | Q1.1 17.45,52.5 18.5,52.5 v18.75,52.25 | Q1.4 15.5,49.88 v15,49.38
  Bottom 0.2: v16.5,47.5 17,48.12 17,52.25 17.25,52.5 18.5,52.5 v18.75,52.25 | IC1.23 16.5,45.22 v16.5,47.5 | v15,49.38 v16.5,47.5
RELAY_PIN  (via drill 0.35)
  Bottom 0.2: IC1.20 16.91,41.41 15.43,39.93 J1.2.2B
  other vias: 14.23,39.93
SCL  (via drill 0.35)
  Top 0.2: IC2.6 20.5,25 21.5,25 21.5,28.5 22.5,29.5 24.16,29.5 IC1.8 | IC7.4 24.91,30.85 IC1.8 | v25.21,33 22.6,33 R12.6 | IC8.4 29.5,31.52 29.5,30.55 IC1.8
  Bottom 0.2: v25.21,33 IC1.8
  other vias: 25.21,30.55
SCLK0
  Bottom 0.2: IC6.5 14.2,24.3 13.5,25 13.5,29.5 13,30 13,34 14.5,35.5 16,35.5 16.45,35.05 IC1.15 19.3,35.05 20.5,36.25 35.5,36.25 37.25,34.5 37.25,30.75 35.62,29.12 35,29.12 35,27.25 35.75,26.5 39,26.5 40.75,25 IC5.1 42.62,25 43.5,25.88 51.25,25.88 51.88,25.25 51.88,18.75 50.92,17.8 IC4.1
SDA  (via drill 0.35)
  Top 0.2: 22,32.15 IC7.6 27.75,32.15 | 22,32.15 22,30.38 21.62,30 20.5,30 IC2.1 | IC8.3 27.77,32.17 27.75,32.15 | 22,32.15 22,33 21.75,33 R12.5 | 27.75,32.15 v27.75,32
  Bottom 0.2: v27.75,32 IC1.6
SHUNT_N
  Bottom 0.2: R15.2 48.9,12.35 P3.1.1 49.75,12.5 R15.1 50.25,14 R10.4
SHUNT_P
  Bottom 0.2: R15.3 48.1,12.35 P2.1.1 | P2.1.1 48.75,11 50.25,11 R10.1 | R15.4 47.25,12.5 P2.1.1
TEST
  Bottom 0.2: IC1.26 21.4,49.25 20.55,50.1 R5.3
VCC  (via drill 0.35)
  Top 0.2: 29.5,32.83 29.5,32.17 IC8.6 31.57,32.17 C40.C 33.3,31.75 C41.C 33.8,31.55 34.8,32.55 35,32.55 | 29.5,32.83 29.5,33.48 IC8.8 | 29.5,32.83 IC8.2 26.68,32.83 25.5,34 24,34 23.4,34.6 R12.7 R12.2 | R12.2 R12.3 R12.4 20.75,35.75 C11.C | R12.1 R12.2 | IC2.4 18.5,25 | 18.5,25 19.5,25 IC2.5 | C13.C 17.75,32.25 18.45,32.95 C39.C 19.5,34 | IC7.1 19.9,33.25 C38.C 19.5,34 | C14.C 16.55,30.5 C13.C | 18.5,25 v17.75,25 17.75,27.6 | IC2.3 18.5,30.5 C13.C | C11.C v20.5,34.5 20,34 19.5,34 | C11.C 19.2,35.75 C12.C 17.95,35.55 17.1,36.4 D5.A | C3.C 11.95,28.5 R1.A 10.45,28.7 PW1.6 13.2,29.85 C4.C 15.45,28.6 D3.C 17.75,27.6 | R13.1 35.5,23.75 | 35.5,21.55 35.5,23.75 | 35.5,21.55 D7.2 | H1.1.1 35,47.19 35,32.55 | C24.C 48.7,21.75 C23.C v50,20.5 36.55,20.5 35.5,21.55 | 35,32.55 35.2,32.55 36.25,31.5 36.25,28.88 35.2,27.82 C37.C 35,27.3 C36.C 35.5,24.75 | C13.C 17.75,27.6 | 35.5,23.75 35.5,24.75 | 35.5,24.75 v35.75,24.75
  Bottom 0.2: IC6.4 17.35,25.4 v17.75,25 18,24.75 C34.C 19.8,23.75 C35.C | IC1.11 21.4,33.6 v20.5,34.5 | IC5.9 36,24.5 v35.75,24.75 | IC4.9 49.75,20.75 v50,20.5
VIN  (via drill 0.35)
  Top 0.2: D4.C 12.85,44.25 14.25,44.25 15.5,43 15.5,41.55 J1.2.1B 15.89,40.5 D1.A
  other vias: 15.17,41.22

### Text on the board
tPlace: GND | SWD CLK | SWD IO | 3.3V | HS100R | Rev0A | LUX | NRF51 | BAR | RH%
bPlace: GND | IO | CLK